# Altium schematic sheet 05_Communication.SchDoc: Communication
size A4; SheetNumber: 7; SheetTotal: 10
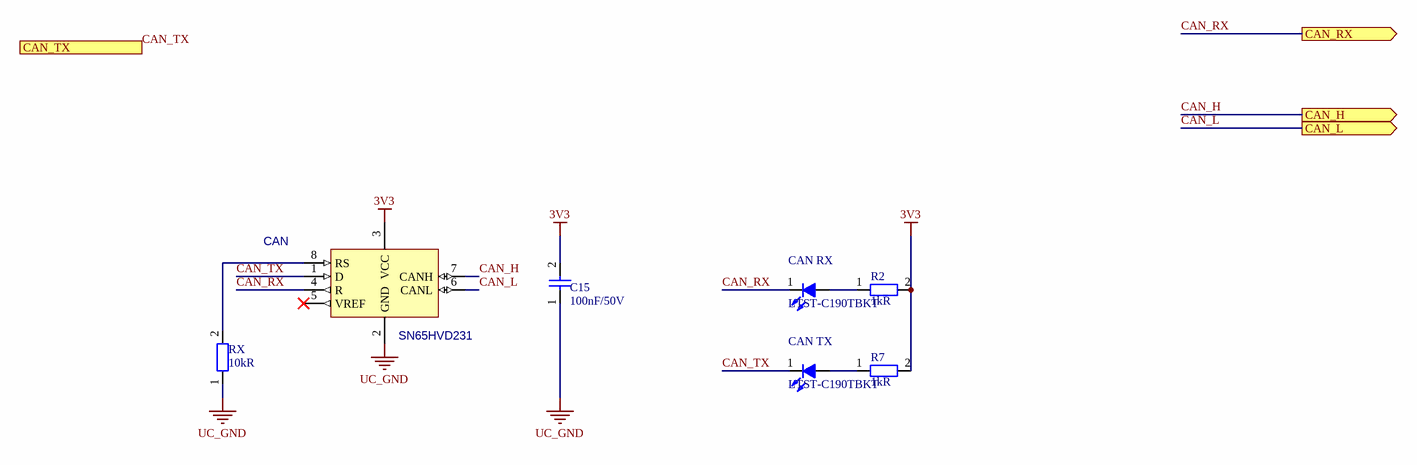
[diagram p0: 05_Communication.SchDoc]

## Parts
C15  100nF/50V  [CAPC1005X05L]
CAN  SN65HVD231  [SOIC127P600X175-8L]
CAN_RX  LTST-C190TBKT  [LEDSC160X80X80-2Lbl]
CAN_TX  LTST-C190TBKT  [LEDSC160X80X80-2Lbl]
R2  1kR  [RESC1005X04L]
R7  1kR  [RESC1005X04L]
RX  10kR  [RESC1005X04L]

## Ports
CAN_H (out), CAN_L (out), CAN_RX (out), CAN_TX (in)

## Nets
3V3: C15.2 CAN.3(VCC) R2.2 R7.2
UC_GND: C15.1 CAN.2(GND) RX.1
CAN_H: CAN.7(CANH) ; port CAN_H
CAN_L: CAN.6(CANL) ; port CAN_L
CAN_RX: CAN.4(R) CAN_RX.1(K) ; port CAN_RX
CAN_TX: CAN.1(D) CAN_TX.1(K) ; port CAN_TX
NetCAN_8: CAN.8(RS) RX.2
NetCAN_RX_2: CAN_RX.2(A) R2.1
NetCAN_TX_2: CAN_TX.2(A) R7.1

Not connected (* = marked no-connect by the designer): CAN 5(VREF)*

## Notes on the sheet
- Schematic Name
- Document Number
- File:
- Sheet
- Size
- A4
- Project Name
- of
- Print date:
- Drawn by:
- Revision
- Repo:
- Variant:

## Library data of the parts
C15 = CMP-001-00067-18: Cap MLCC, 100nF, 50V, X7R, 10%, 0402; Value: 100nF; Case/Package: 0402; Case Code (Metric): 1005; Dielectricum: X7R; Mounting Technology: SMD; Tolerance: 10%; Type: MLCC; Voltage Rating: 50V
CAN = CMP-00196-7: Bus Interface, CAN Transceiver, 3..3.6V, 1 Ch, SOIC-8, L5B3.98H1.75; Channels: 1; Max Supply Voltage: 3.6V; Min Supply Voltage: 3V; Bus Type: CAN Transceiver; Case/Package: SOIC-8; Mounting Technology: SMD; Size: L5B3.98H1.75
CAN_RX CAN_TX = CMP-007-00026-12: LED, Blue, 20mA, 2.8V, 0603; Case/Package: 0603; Color: Blue; Forward Voltage: 2.8V; Mounting Technology: SMD; Rated Current: 20mA; Size: L1.6B0.8H0.8
R2 R7 = CMP-009-00009-32: Res, 1kR, 1%, 0.1W, 0402; Value: 1k; Power: 100mW; Voltage Rating: 50V; Case/Package: 0402; Case Code (Metric): 1005; Mounting Technology: SMD; Tolerance: 1%; Type: Fixed
RX = CMP-009-00149-32: Res, 10kR, 1%, 0.1W, 0402; Value: 10k; Power: 100mW; Voltage Rating: 50V; Case/Package: 0402; Case Code (Metric): 1005; Mounting Technology: SMD; Tolerance: 1%; Type: Fixed